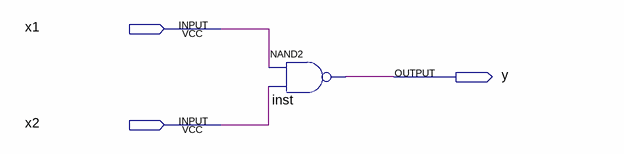
[diagram p0: schematic sheet]
// Quartus schematic lab13.bdf as structural Verilog: 1 symbols, 3 pins
module lab13 (
  input  x1,
  input  x2,
  output y
);

  nand inst (y, x1, x2);
endmodule
